# EAGLE schematic BCProjectBoardV2 (EAGLE 9.1.3)
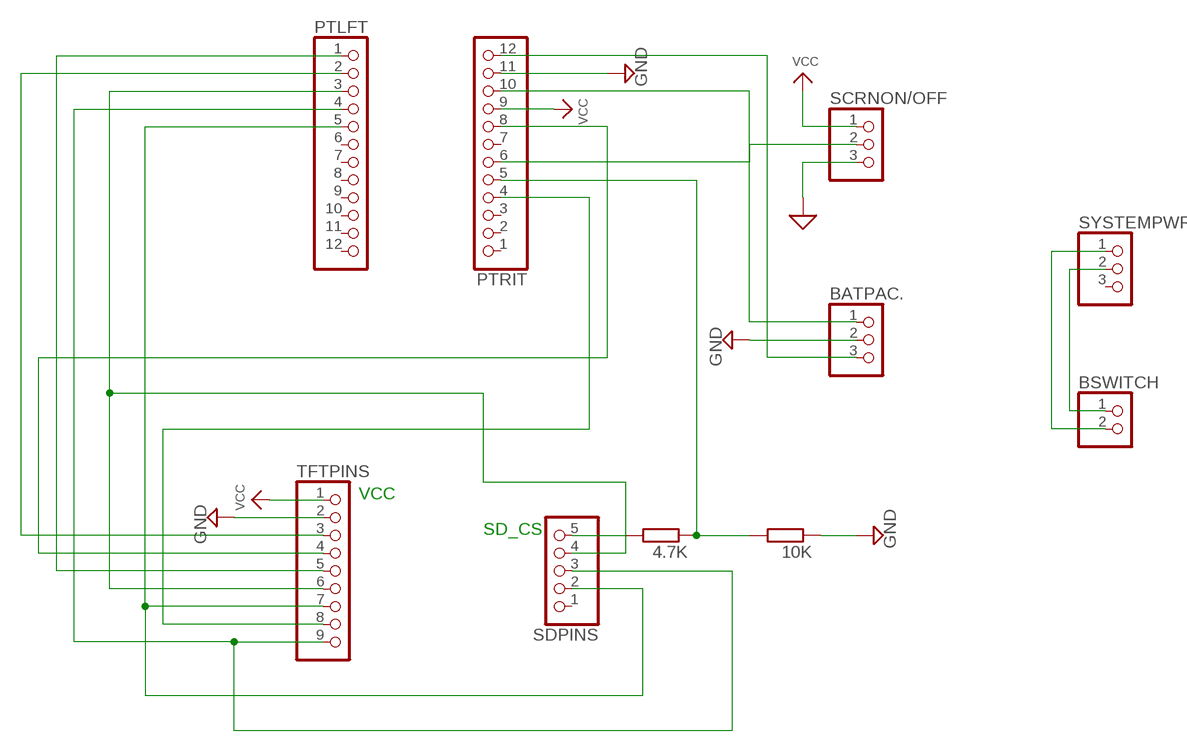
[diagram p0: schematic, sheet 1]

## Parts
4.7K  R-EU_0204/5  [0204/5]
10K  R-EU_0204/5  [0204/5]
BATPAC.  PINHD-1X3  [1X03]
BSWITCH  PINHD-1X2  [1X02]
PTLFT  PINHD-1X12  [1X12]
PTRIT  PINHD-1X12  [1X12]
SCRNON/OFF  PINHD-1X3  [1X03]
SDPINS  PINHD-1X5  [1X05]
SYSTEMPWR  PINHD-1X3  [1X03]
TFTPINS  PINHD-1X9  [1X09]

## Nets
GND: 10K.1 BATPAC..2 PTRIT.11 SCRNON/OFF.3 TFTPINS.2 ; supply symbol labelled SUP
N$1: 4.7K.2 SDPINS.5
N$2: 4.7K.1 10K.2 PTRIT.5
N$3: PTLFT.4 SDPINS.3 TFTPINS.9
N$4: PTRIT.4 TFTPINS.8
N$5: PTLFT.5 SDPINS.2 TFTPINS.7
N$6: PTLFT.3 SDPINS.4 TFTPINS.6
N$7: PTLFT.1 TFTPINS.5
N$8: PTRIT.8 TFTPINS.4
N$9: PTLFT.2 TFTPINS.3
N$10: PTRIT.6 SCRNON/OFF.2
N$11: BSWITCH.1 SYSTEMPWR.2
N$12: BSWITCH.2 SYSTEMPWR.1
N$13: BATPAC..3 PTRIT.12
N$14: BATPAC..1 PTRIT.10
VCC: PTRIT.9 SCRNON/OFF.1 TFTPINS.1
Unconnected: PTLFT.6 PTLFT.7 PTLFT.8 PTLFT.9 PTLFT.10 PTLFT.11 PTLFT.12 PTRIT.1 PTRIT.2 PTRIT.3 PTRIT.7 SDPINS.1 SYSTEMPWR.3

## Notes on the sheet
- VCC
- SD_CS

## Library data of the parts
4.7K 10K = rcl:R-EU_: RESISTOR, European symbol; SPICEPREFIX: R
BATPAC. SCRNON/OFF SYSTEMPWR = pinhead:PINHD-1X3: PIN HEADER
BSWITCH = pinhead:PINHD-1X2: PIN HEADER
PTLFT PTRIT = pinhead:PINHD-1X12: PIN HEADER
SDPINS = pinhead:PINHD-1X5: PIN HEADER
TFTPINS = pinhead:PINHD-1X9: PIN HEADER